# EAGLE design avip-mod v4 top (EAGLE 9.6.2)
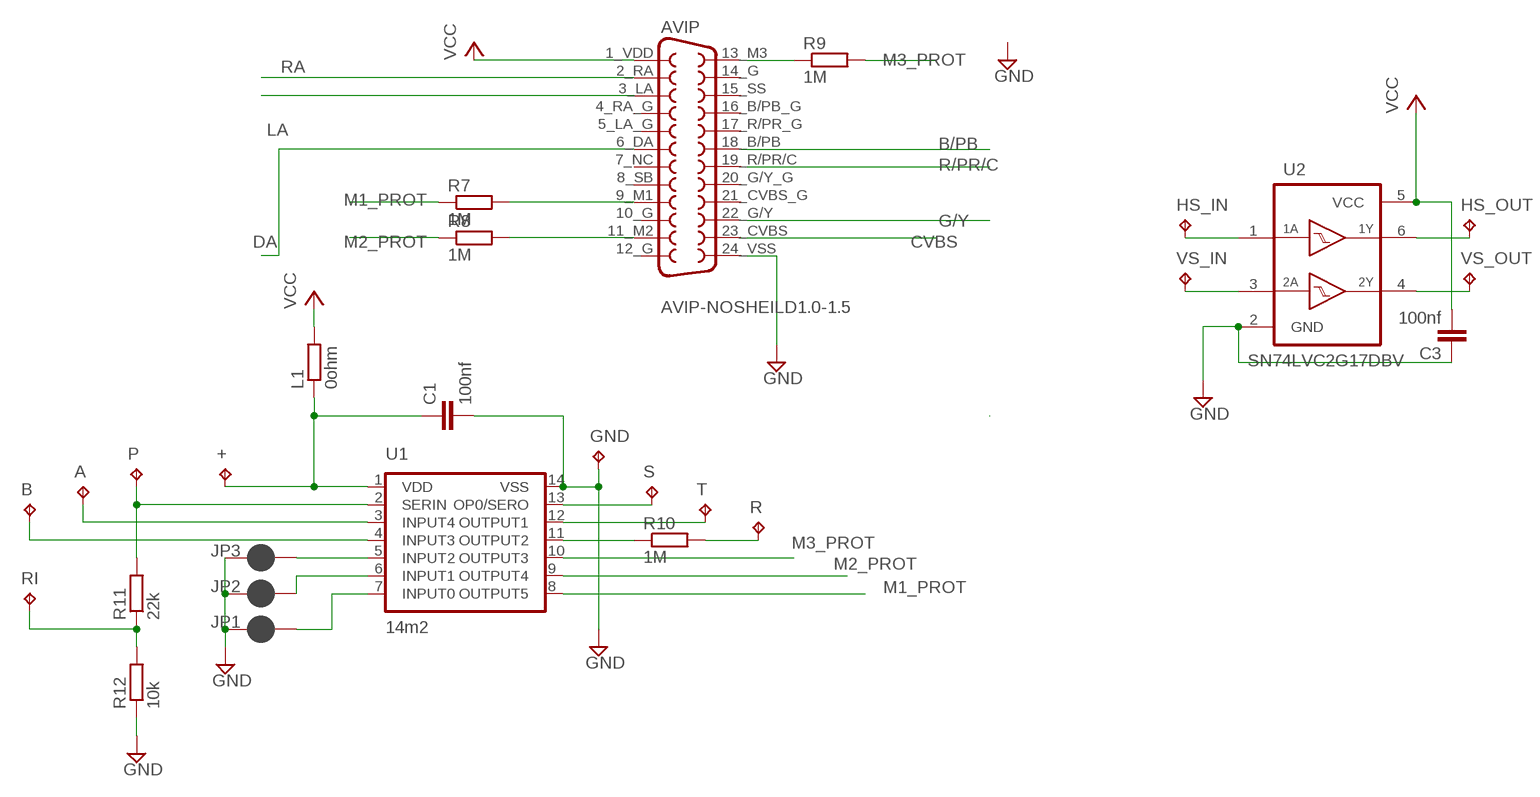
[diagram p0: schematic, sheet 1]

## Parts
+  TPTP07SQ  [TP07SQ]
A  TPTP07SQ  [TP07SQ]
AVIP  AVIP-NOSHEILD1.0-1.5  [AVIP-1.0-1.5-NOSHEILD]
B  TPTP07SQ  [TP07SQ]
C1  100nf  C-EUC0603  [C0603]
C3  100nf  C-EUC0603  [C0603]
GND  TPTP07SQ  [TP07SQ]
HS_IN  TPTP07SQ  [TP07SQ]
HS_OUT  TPTP07SQ  [TP07SQ]
JP1  JUMPER-SMT_NO-SILK  [SMT-JUMPER]
JP2  JUMPER-SMT_NO-SILK  [SMT-JUMPER]
JP3  JUMPER-SMT_NO-SILK  [SMT-JUMPER]
L1  0ohm  R-EU_R0603  [R0603]
P  TPTP07SQ  [TP07SQ]
R  TPTP07SQ  [TP07SQ]
R7  1M  R-EU_R0603  [R0603]
R8  1M  R-EU_R0603  [R0603]
R9  1M  R-EU_R0603  [R0603]
R10  1M  R-EU_R0603  [R0603]
R11  22k  R-EU_R0603  [R0603]
R12  10k  R-EU_R0603  [R0603]
RI  TPTP07SQ  [TP07SQ]
S  TPTP07SQ  [TP07SQ]
T  TPTP07SQ  [TP07SQ]
U1  14m2  PICAXE-14AXE017M2SM  [SO14]
U2  SN74LVC2G17DBV  [SOT23-6]
VS_IN  TPTP07SQ  [TP07SQ]
VS_OUT  TPTP07SQ  [TP07SQ]

## Nets
A: A.TP U1.3(INPUT4)
B: B.TP U1.4(INPUT3)
B/PB [video length]: AVIP.18_B/PB
CVBS: AVIP.23_CVBS
DA: AVIP.6_DA
G/Y [video length]: AVIP.22_G/Y
GND: AVIP.24_VSS(25_VSS) C1.2 C3.1 GND.TP JP1.1 JP2.1 JP3.1 R12.1 U1.14(VSS) U2.2(GND)
H_SYNC_IN: HS_IN.TP U2.1(1A)
H_SYNC_OUT [sync length]: HS_OUT.TP U2.6(1Y)
LA: AVIP.3_LA
M1: AVIP.9_M1 R7.2
M1_PROT: R7.1 U1.8(OUTPUT5)
M1S: JP1.2 U1.7(INPUT0)
M2: AVIP.11_M2 R8.2
M2_PROT: R8.1 U1.9(OUTPUT4)
M2S: JP2.2 U1.6(INPUT1)
M3: AVIP.13_M3 R9.1
M3_PROT: R9.2 U1.10(OUTPUT3)
M3S: JP3.2 U1.5(INPUT2)
PROG: P.TP R11.2 U1.2(SERIN)
R/PR/C [video length]: AVIP.19_R/PR/C
RA: AVIP.2_RA
RESET: R10.2 R.TP
RESET_PROT: R10.1 U1.11(OUTPUT2)
RING: R11.1 R12.2 RI.TP
SPEAK: S.TP U1.13(OP0/SERO)
TOGGLE: T.TP U1.12(OUTPUT1)
V_SYNC_IN: U2.3(2A) VS_IN.TP
V_SYNC_OUT [sync length]: U2.4(2Y) VS_OUT.TP
VCC: AVIP.1_VDD C3.2 L1.2 U2.5(VCC)
VDD: +.TP C1.1 L1.1 U1.1(VDD)
Unconnected: AVIP.4_RA_G AVIP.5_LA_G AVIP.7_NC AVIP.8_SB AVIP.10_G AVIP.12_G AVIP.14_G AVIP.15_SS AVIP.16_B/PB_G AVIP.17_R/PR_G AVIP.20_G/Y_G AVIP.21_CVBS_G

## Library data of the parts
+ A B GND HS_IN HS_OUT P R RI S T VS_IN VS_OUT = testpad:TP: Test pad
AVIP = XBOX:AVIP-NOSHEILD
C1 C3 = rcl:C-EU: CAPACITOR, European symbol; SPICEPREFIX: C
JP1-JP3 = XBOX:JUMPER-SMT: Normally closed solder jumper This jumper has an aperture in the stencil to allow solder paste to bridge the split in the wire so it's normally closed (NC). Wick off the solder to open the connection. Reapply solder to reclose the connection.
L1 R7-R12 = rcl:R-EU_: RESISTOR, European symbol; SPICEPREFIX: R
U1 = XBOX:PICAXE-14
U2 = XBOX:SN74LVC2G17: DUAL SCHMITT-TRIGGER BUFFER

## Net classes
0 standard: width 0.25 mm, clearance 0.205 mm
1 video length: width 0.25 mm, clearance 0.205 mm to class 0, clearance 0.205 mm
2 sync length: width 0.25 mm, clearance 0.205 mm to class 0, clearance 0.205 mm to class 1, clearance 0.205 mm

## Board
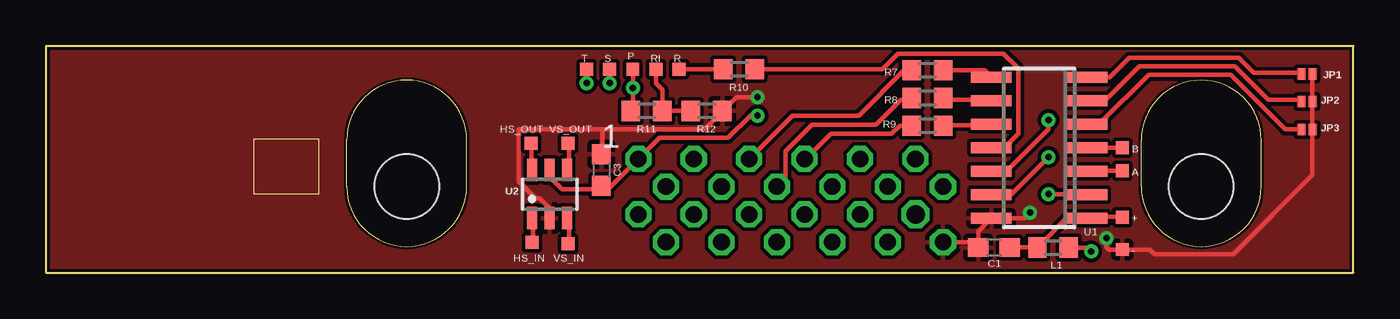
[diagram p1: board, top side]
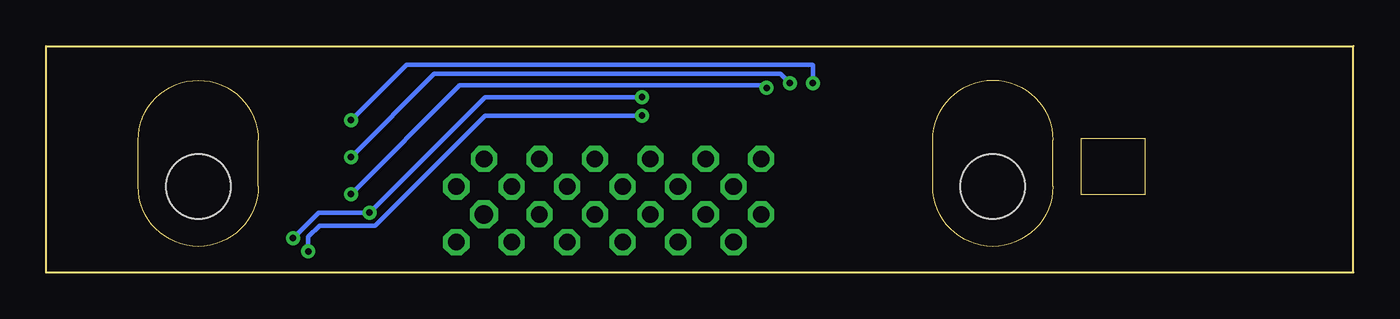
[diagram p2: board, bottom side, seen from below]

Size 70.75 x 12.25 mm. Coordinates in mm from the lower left corner, seen from the top.
Outline: 70.75,12.25 0,12.25 0,0 70.75,0 70.75,12.25
Copper layers (1*16): Top 0.035mm / dielectric 1.5mm / Bottom 0.035mm
Design rules "default *": minimum track width 6mil, minimum drill 0.35mm, track to track 6mil, track to pad 6mil, pad to pad 6mil, via to via 6mil, smd to smd 6mil, copper to edge 6mil, drill to drill 6mil, minimum pad ring 10mil, minimum via ring 8mil, stop-mask expansion 4mil, vias tented up to drill 15mm, thermal gap 10mil
Milling: 4 lines

### Footprints (pad centres in the part's own frame; a part is rotated, then mirrored left to right if it is on the bottom)
TP07SQ = smd 0.7 x 0.7: TP 0,0
AVIP-1.0-1.5-NOSHEILD = drill 0.9 octagon: 1_VDD -28.5,4.5; 2_RA -28.5,1.5; 3_LA -27,3; 4_RA_G -27,0; 5_LA_G -25.5,4.5; 6_DA -25.5,1.5; 7_NC -24,3; 8_SB -24,0; 9_M1 -22.5,4.5; 10_G -22.5,1.5; 11_M2 -21,3; 12_G -21,0; 13_M3 -19.5,4.5; 14_G -19.5,1.5; 15_SS -18,3; 16_B/PB_G -18,0; 17_R/PR_G -16.5,4.5; 18_B/PB -16.5,1.5; 19_R/PR/C -15,3; 20_G/Y_G -15,0; 21_CVBS_G -13.5,4.5; 23_CVBS -12,3; 24_VSS -12,0 | drill 1 octagon: 22_G/Y -13.5,1.5 | hole 3.5: -41.035,3.01; 1.965,3.01
C0603 = smd 1.1 x 1: 1 -0.85,0; 2 0.85,0
SMT-JUMPER = smd 0.305 x 0.61: 1 0.3,0; 2 -0.312,0
R0603 = smd 1 x 1.1: 1 -0.85,0; 2 0.85,0
SO14 = smd 0.6 x 2.2: 1 -3.81,-2.6; 2 -2.54,-2.6; 3 -1.27,-2.6; 4 0,-2.6; 5 1.27,-2.6; 6 2.54,-2.6; 7 3.81,-2.6; 8 3.81,2.6; 9 2.54,2.6; 10 1.27,2.6; 11 0,2.6; 12 -1.27,2.6; 13 -2.54,2.6; 14 -3.81,2.6
SOT23-6 = smd 0.55 x 1.2: 1 -0.95,-1.3; 2 0,-1.3; 3 0.95,-1.3; 4 0.95,1.3; 5 0,1.3; 6 -0.95,1.3

### Placement (x,y rotation side)
+  58.25,3 90 top
A  58.25,5.5 90 top
AVIP  60.55,1.65 0 top
B  58.25,6.75 90 top
C1  51.3,1.35 180 top
C3  30.05,5.55 270 top
GND  58.25,1.25 0 top
HS_IN  26.3,1.65 180 top
HS_OUT  26.25,7 180 top
JP1  68.25,10.75 0 top
JP2  68.25,9.25 0 top
JP3  68.25,7.75 0 top
L1  54.5,1.35 0 top
P  31.75,11 90 top
R  34.25,11 0 top
R7  47.7,10.95 180 top
R8  47.7,9.45 180 top
R9  47.7,7.95 0 top
R10  37.5,11 180 top
R11  32.5,8.75 180 top
R12  35.75,8.75 180 top
RI  33,11 0 top
S  30.5,11 0 top
T  29.25,11 0 top
U1  53.75,6.75 90 top
U2  27.25,4.25 0 top
VS_IN  28.25,1.55 180 top
VS_OUT  28.25,7 180 top

### Tracks (layer width: path | path; a pad name or v marks a point on that pad's centre or on a via)
A
  Top 0.25: A.TP 58.2,5.51 56.38,5.51 U1.3
B
  Top 0.25: B.TP 58.2,6.77 56.38,6.77 U1.4
GND  (via drill 0.35)
  Top 0.25: JP1.1 68.54,10.71 68.54,9.35 JP2.1 68.54,9.23 JP3.1 68.54,7.64 68.54,5.29 64.25,1 60,1 59.75,1.25 GND.TP 57.5,1.25 57.39,1.36 v57.39,1.86 | 51.25,2.86 51.19,2.91 51.18,2.91 U1.14 | U2.2 27.27,2.95 27.28,3.03 | 30.12,7.75 25.57,7.75 25.57,4.93 26.48,4.02 26.7,4.02 27.16,3.57 27.16,3.05 27.23,2.98 | 30.12,7.75 35.64,7.75 36.59,8.7 R12.1 37.35,9.5 v38.5,9.5 | 27.23,2.98 U2.2 | 30.12,7.75 30.12,6.41 C3.1 | AVIP.24_VSS 50.15,1.65 C1.2 50.45,2.24 U1.14 | U1.14 52.94,2.94 v53.25,3.25 | 27.28,3.03 U2.2 | 27.28,3.03 27.23,2.98
  Bottom 0.25: v38.5,9.5 47,9.5 v53.25,3.25 56.01,3.25 v57.39,1.86
  pour Top: 0,12.25 70.75,12.25 70.75,0 0,0
H_SYNC_IN
  Top 0.25: 26.36,2.92 26.36,2.95 U2.1 | 26.36,2.92 26.36,1.66 HS_IN.TP | 26.36,2.92 26.37,2.92 U2.1
H_SYNC_OUT
  Top 0.25: HS_OUT.TP | HS_OUT.TP | HS_OUT.TP 26.26,7.02 HS_OUT.TP 26.26,6.9 26.26,5.65 U2.6
M1
  Top 0.25: R7.2 46.82,10.94 46.44,10.94 44,8.5 40.4,8.5 AVIP.9_M1
M1_PROT
  Top 0.25: R7.1 48.64,10.94 50.8,10.94 51.14,10.6 U1.8
M1S
  Top 0.25: U1.7 57.56,10.56 58.62,11.62 64.56,11.62 65.36,10.82 67.97,10.82 JP1.2
M2
  Top 0.25: R8.2 46.82,9.35 46.27,9.35 44.92,8 41.44,8 40.02,6.58 40.02,5.12 AVIP.11_M2
M2_PROT
  Top 0.25: R8.1 48.64,9.35 51.14,9.35 U1.9
M2S
  Top 0.25: JP2.2 67.97,9.35 66.15,9.35 64.33,11.17 59.17,11.17 57.35,9.35 56.37,9.35 U1.6
M3
  Top 0.25: R9.1 46.2,7.95 45.75,7.5 42.47,7.5 41.13,6.16 AVIP.13_M3
M3_PROT
  Top 0.25: R9.2 48.64,7.98 51.14,7.98 U1.10
M3S
  Top 0.25: JP3.2 67.97,7.75 67.06,7.75 64.11,10.71 59.67,10.71 57.05,8.09 56.37,8.09 U1.5
PROG  (via drill 0.35)
  Top 0.25: 31.75,11.25 | 31.75,11.25 31.87,11.13 P.TP | 31.75,11.25 31.76,11.24 | v54.25,4.25 56.14,4.25 U1.2 | R11.2 31.75,8.85 v31.75,10 31.75,11.25 | 31.75,11.25
  Bottom 0.25: v54.25,4.25 48.38,10.12 31.88,10.12 v31.75,10 | v31.75,10 | v31.75,10
RESET
  Top 0.25: R10.2 R.TP
RESET_PROT
  Top 0.25: R10.1 45.25,11 46.1,11.85 51.82,11.85 52.62,11.05 52.62,7.53 51.94,6.84 51.25,6.84 U1.11
RING
  Top 0.25: RI.TP 33,10.25 33.35,9.9 R11.1 R12.2
SPEAK  (via drill 0.35)
  Top 0.25: 50.46,4.23 51.14,4.23 U1.13 52.21,4.21 v54.25,6.25 | v30.5,10.25 S.TP
  Bottom 0.25: v54.25,6.25 49.75,10.75 31,10.75 v30.5,10.25
TOGGLE  (via drill 0.35)
  Top 0.25: T.TP v29.25,10.25 | v54.25,8.25 54.25,7.75 52.09,5.59 51.25,5.59 U1.12
  Bottom 0.25: v29.25,10.25 29.25,11.23 29.27,11.25 51.25,11.25 v54.25,8.25
V_SYNC_IN
  Top 0.25: 28.3,2.92 28.3,2.95 U2.3 | 28.3,2.92 28.3,1.66 VS_IN.TP | 28.3,2.92 28.31,2.92 U2.3
V_SYNC_OUT
  Top 0.25: VS_OUT.TP 28.31,7.01 28.31,7.02 VS_OUT.TP 28.31,6.9 28.31,5.65 U2.4
VCC  (via drill 0.35)
  Top 0.25: 27.27,5.5 27.27,5.16 27.93,4.5 29.95,4.5 C3.2 30.02,4.5 30.4,4.5 AVIP.1_VDD 33.2,7.29 36.91,7.29 38.12,8.5 v38.5,8.5 | 27.27,5.5 27.26,5.55 | 55.26,1.27 L1.2 56.37,1.35 v56.57,1.15 | U2.5 27.28,5.54 27.27,5.5
  Bottom 0.25: v56.57,1.15 56.57,1.93 55.96,2.54 52.96,2.54 47,8.5 v38.5,8.5
VDD
  Top 0.25: C1.1 52.21,1.38 53.55,1.38 L1.1 | 53.66,1.38 L1.1 | +.TP 58.2,3.01 56.38,3.01 U1.1 56.27,3.01 55.31,3.01 L1.1

### Text on the board
tSilk: B | A | + | -